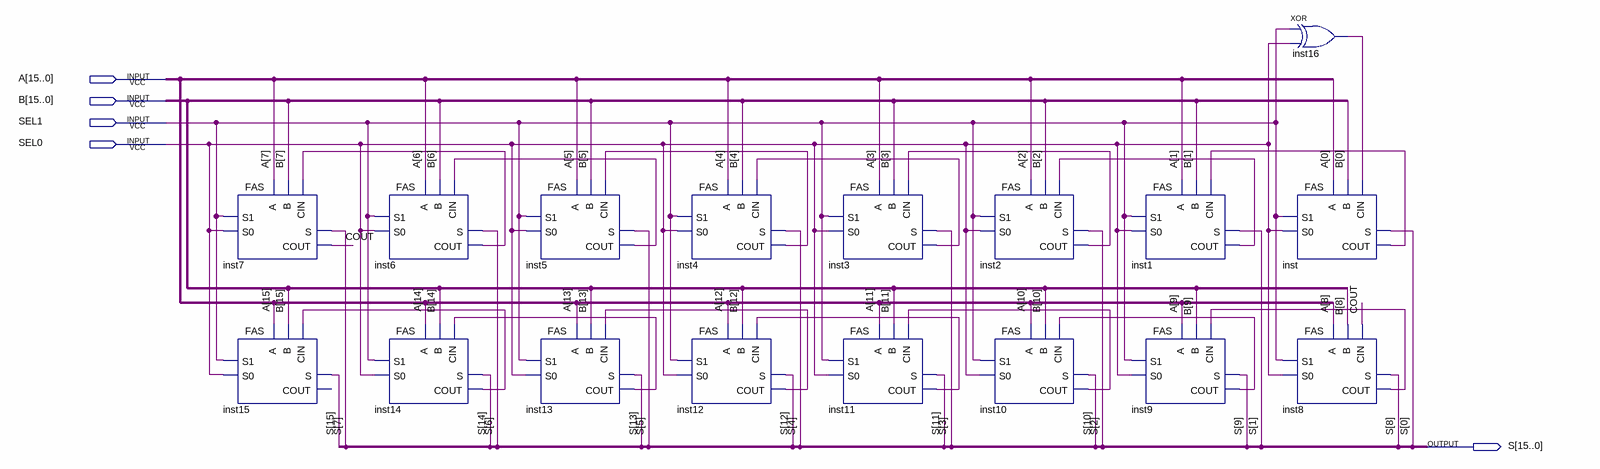
[diagram p0: schematic sheet]
// Quartus schematic AU.bdf as structural Verilog: 17 symbols, 5 pins
module AU (
  input  [15:0] A,
  input  [15:0] B,
  input  SEL1,
  input  SEL0,
  output [15:0] S
);

  wire COUT, inst1_cout, inst2_cout, inst3_cout, inst4_cout, inst5_cout, inst6_cout, inst8_cout, inst9_cout,
       inst10_cout, inst11_cout, inst12_cout, inst13_cout, inst14_cout, inst16_out, inst_cout;

  FAS inst7 (.CIN(inst6_cout), .A(A[7]), .B(B[7]), .S1(SEL1), .S0(SEL0), .S(S[7]), .COUT(COUT));
  FAS inst15 (.CIN(inst14_cout), .A(A[15]), .B(B[15]), .S1(SEL1), .S0(SEL0), .S(S[15]));  // open: COUT
  FAS inst6 (.CIN(inst5_cout), .A(A[6]), .B(B[6]), .S1(SEL1), .S0(SEL0), .S(S[6]), .COUT(inst6_cout));
  FAS inst14 (.CIN(inst13_cout), .A(A[14]), .B(B[14]), .S1(SEL1), .S0(SEL0), .S(S[14]), .COUT(inst14_cout));
  FAS inst5 (.CIN(inst4_cout), .A(A[5]), .B(B[5]), .S1(SEL1), .S0(SEL0), .S(S[5]), .COUT(inst5_cout));
  FAS inst13 (.CIN(inst12_cout), .A(A[13]), .B(B[13]), .S1(SEL1), .S0(SEL0), .S(S[13]), .COUT(inst13_cout));
  FAS inst4 (.CIN(inst3_cout), .A(A[4]), .B(B[4]), .S1(SEL1), .S0(SEL0), .S(S[4]), .COUT(inst4_cout));
  FAS inst12 (.CIN(inst11_cout), .A(A[12]), .B(B[12]), .S1(SEL1), .S0(SEL0), .S(S[12]), .COUT(inst12_cout));
  FAS inst3 (.CIN(inst2_cout), .A(A[3]), .B(B[3]), .S1(SEL1), .S0(SEL0), .S(S[3]), .COUT(inst3_cout));
  FAS inst11 (.CIN(inst10_cout), .A(A[11]), .B(B[11]), .S1(SEL1), .S0(SEL0), .S(S[11]), .COUT(inst11_cout));
  FAS inst2 (.CIN(inst1_cout), .A(A[2]), .B(B[2]), .S1(SEL1), .S0(SEL0), .S(S[2]), .COUT(inst2_cout));
  FAS inst10 (.CIN(inst9_cout), .A(A[10]), .B(B[10]), .S1(SEL1), .S0(SEL0), .S(S[10]), .COUT(inst10_cout));
  FAS inst1 (.CIN(inst_cout), .A(A[1]), .B(B[1]), .S1(SEL1), .S0(SEL0), .S(S[1]), .COUT(inst1_cout));
  FAS inst9 (.CIN(inst8_cout), .A(A[9]), .B(B[9]), .S1(SEL1), .S0(SEL0), .S(S[9]), .COUT(inst9_cout));
  xor inst16 (inst16_out, SEL1, SEL0);
  FAS inst (.CIN(inst16_out), .A(A[0]), .B(B[0]), .S1(SEL1), .S0(SEL0), .S(S[0]), .COUT(inst_cout));
  FAS inst8 (.CIN(COUT), .A(A[8]), .B(B[8]), .S1(SEL1), .S0(SEL0), .S(S[8]), .COUT(inst8_cout));
endmodule
